# EasyEDA schematic SCH_THS3001宽带放大器2倍250M.json
TITLE: Sheet_1; REV: 1.0; Date: 2024-04-09; Sheet: 1/1; Drawn By: l_galois; Company: Your Company
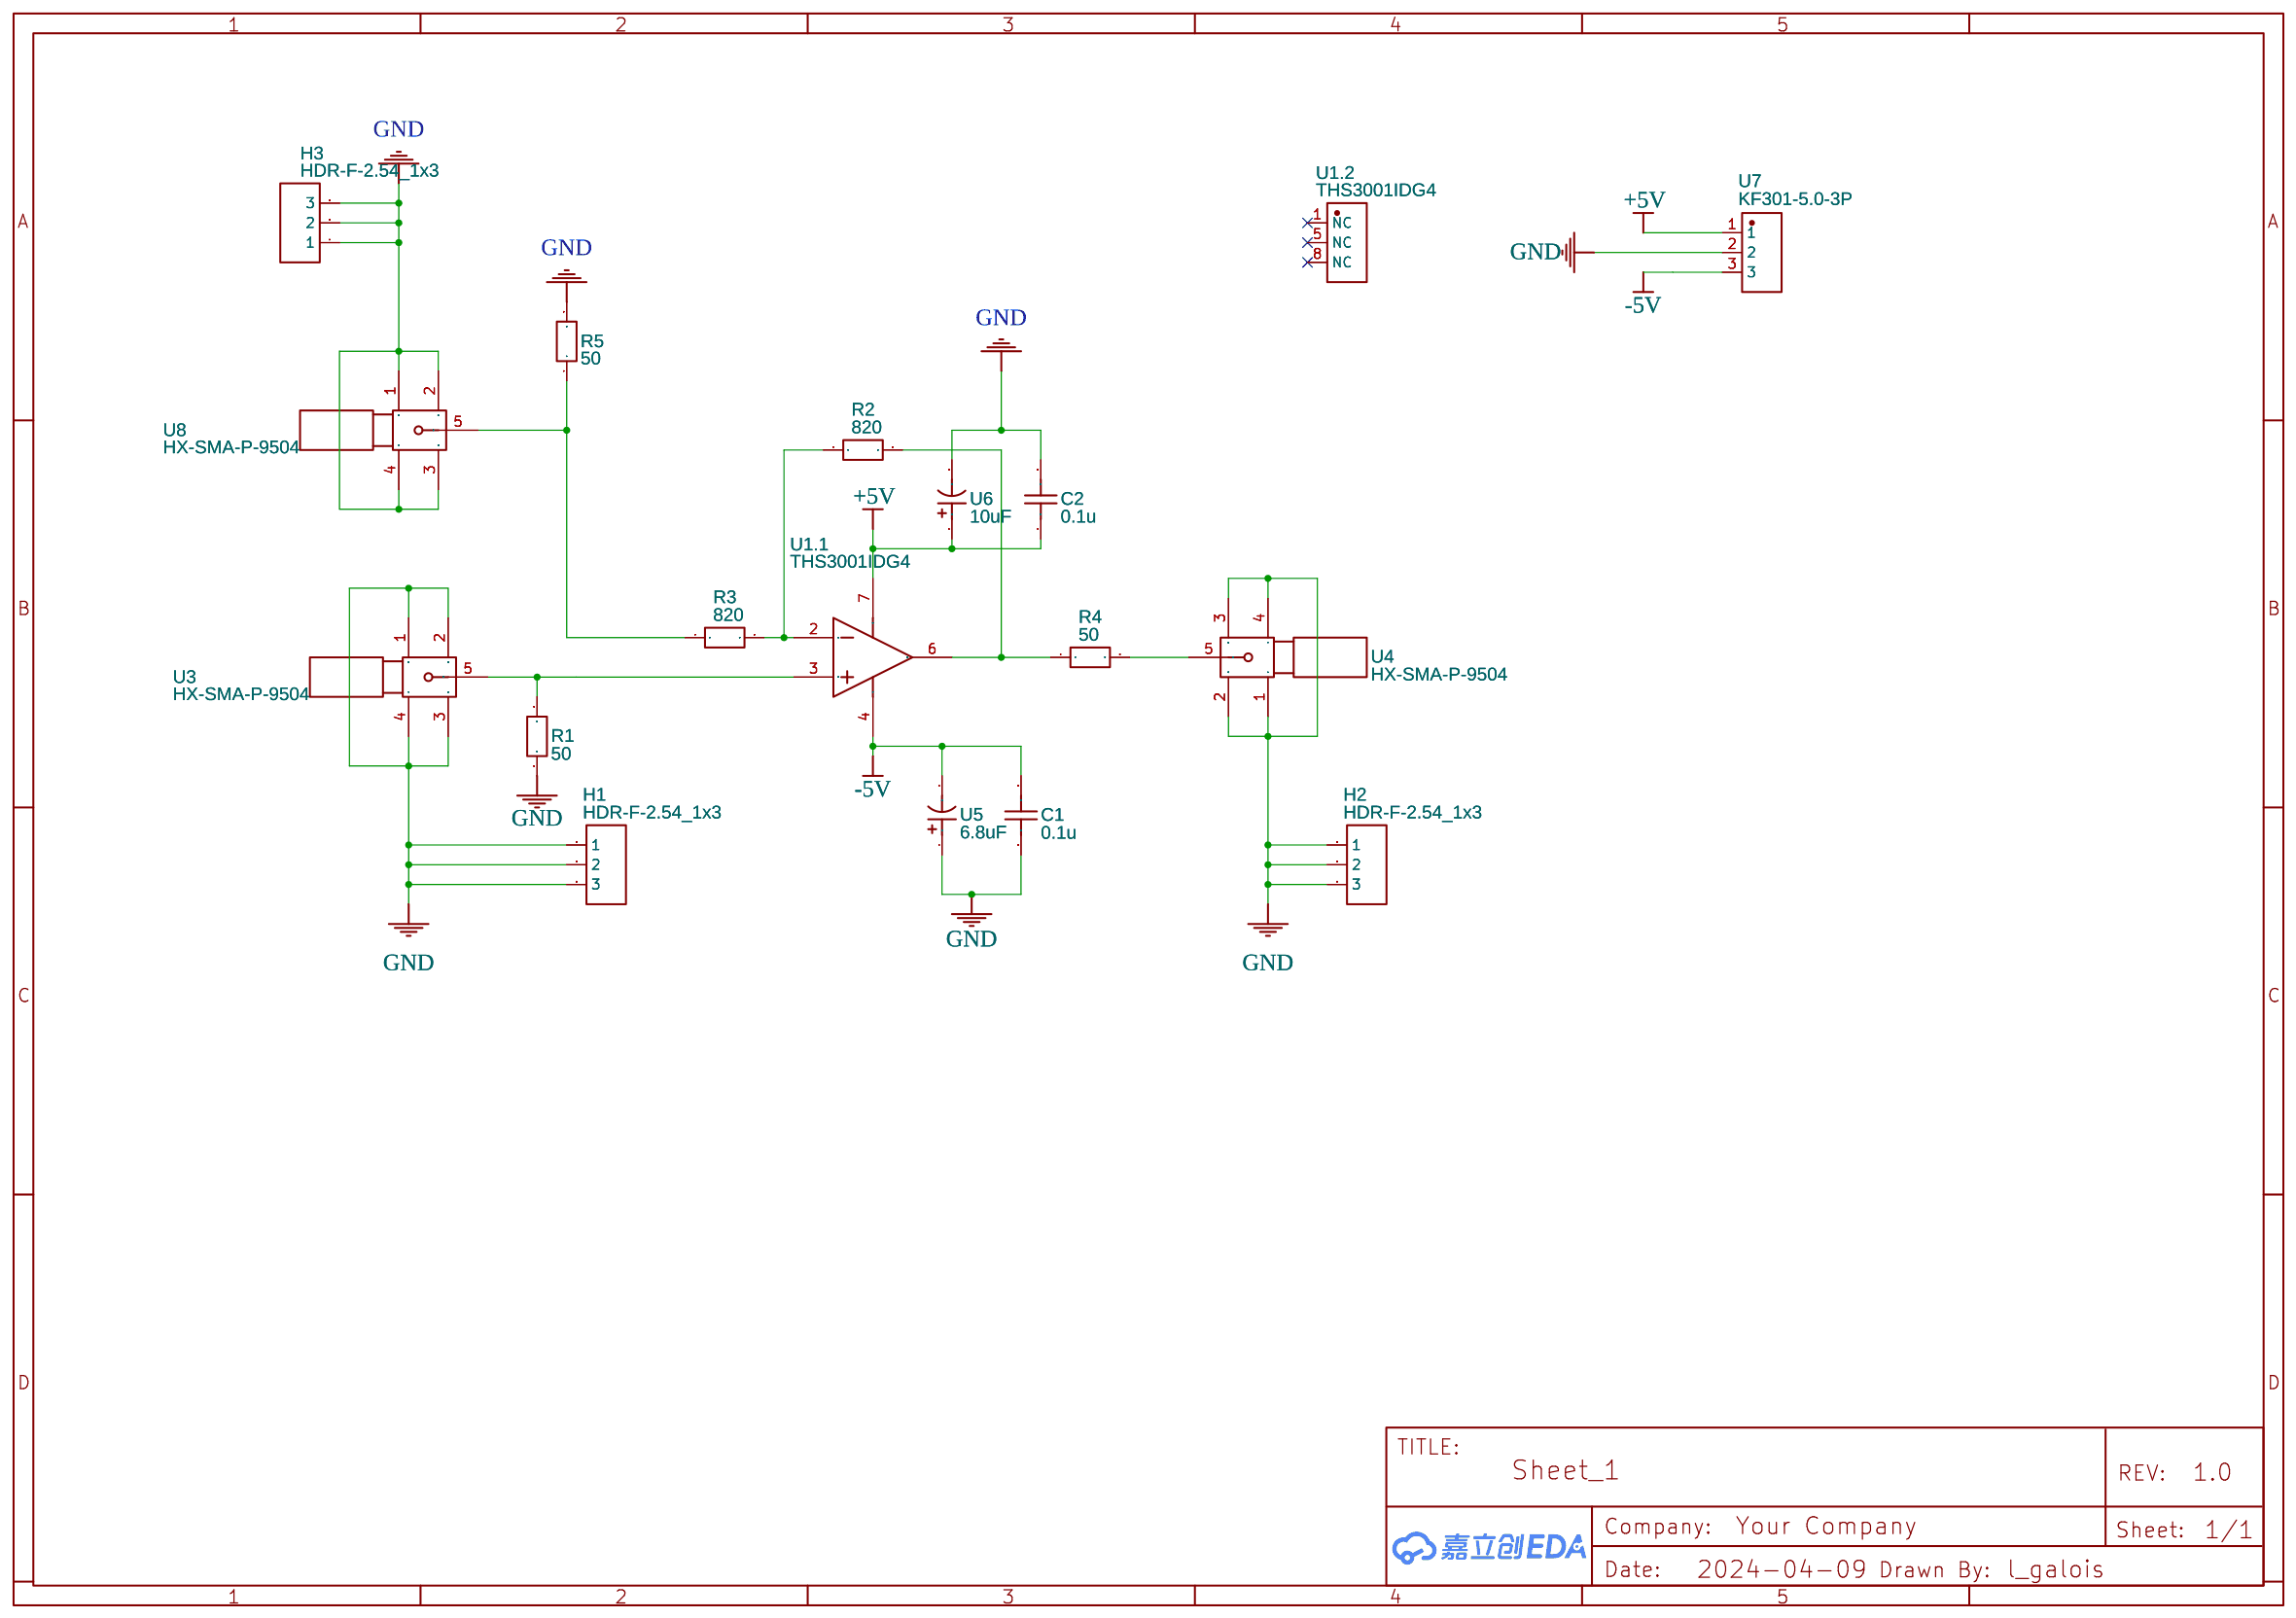
[diagram p0: schematic sheet]

## Parts
C1  0.1u  [C0805]
C2  0.1u  [C0805]
H1  HDR-F-2.54_1x3  [HDR-F-2.54_1X3]
H2  HDR-F-2.54_1x3  [HDR-F-2.54_1X3]
H3  HDR-F-2.54_1x3  [HDR-F-2.54_1X3]
R1  50  [R0805]
R2  820  [R0805]
R3  820  [R0805]
R4  50  [R0805]
R5  50  [R0805]
U1  THS3001IDG4  [SOIC-8_L4.9-W3.9-P1.27-LS6.0-BL]  (sections 1,2)
U3  HX-SMA-P-9504  [RF-SMA-SMD_HX-SMA-P-9631]
U4  HX-SMA-P-9504  [RF-SMA-SMD_HX-SMA-P-9631]
U5  6.8uF  [CAP-SMD_BD5.0-L5.3-W5.3-LS6.1-FD-1]
U6  10uF  [CAP-SMD_BD5.0-L5.3-W5.3-LS6.1-FD-1]
U7  KF301-5.0-3P  [CONN-TH_3P-P5.00_KF301-5.0-3P]
U8  HX-SMA-P-9504  [RF-SMA-SMD_HX-SMA-P-9631]

## Library data of the parts
C1 C2 = C_0805_US: Contributor: LCEDA_Lib
H1-H3 = HDR-F-2.54_1x3: Supplier Part: C146690; Supplier: LCSC; Contributor: LCEDA_Lib
R1-R5 = R_0603_EU: Contributor: LCEDA_Lib
U1 = THS3001IDG4: subpart_no: 1; Supplier: LCSC; Supplier Part: C4368754; Manufacturer: TI(德州仪器); JLCPCB Part Class: Extended Part; link: https://so.szlcsc.com/global.html?k=C4368754&ref=editor
U3 U4 U8 = HX-SMA-P-9504: Contributor: lcsc; Supplier: LCSC; Supplier Part: C5124055; Manufacturer: 环协; JLCPCB Part Class: Extended Part; link: https://so.szlcsc.com/global.html?k=C5124055&ref=editor
U5 U6 = RVT1H331M1010_C3032175: Supplier: LCSC; Supplier Part: C3032175; Manufacturer: ROQANG(容强); Manufacturer Part: RVT1H331M1010; Contributor: lcsc; link: https://so.szlcsc.com/global.html?k=C3032175&ref=editor
U7 = KF301-5.0-3P: Contributor: LCSC; Supplier: LCSC; Supplier Part: C474882; Manufacturer: KEFA(科发); JLCPCB Part Class: Extended Part; link: https://so.szlcsc.com/global.html?k=C474882&ref=editor

## Nets
+5V: C2.1 U1.7(V+) U6.1 U7.1
-5V: C1.2 U1.4(V-) U5.2 U7.3
GND: C1.1 C2.2 H1.1 H1.2 H1.3 H2.1 H2.2 H2.3 H3.1 H3.2 H3.3 R1.2 R5.2 U3.1 U3.2 U3.3 U3.4 U4.1 U4.2 U4.3 U4.4 U5.1 U6.2 U7.2 U8.1 U8.2 U8.3 U8.4
Net-(R1-1): R1.1 U1.3(IN+) U3.5
Net-(R2-1): R2.1 R3.2 U1.2(IN-)
Net-(R2-2): R2.2 R4.1 U1.6(OUT)
Net-(R3-1): R3.1 R5.1 U8.5
Net-(R4-2): R4.2 U4.5

Not connected (* = marked no-connect by the designer): U1 1(NC)* 5(NC)* 8(NC)*
